# Altium schematic sheet Sch.SchDoc
size A3; SheetNumber: 1; SheetTotal: 1
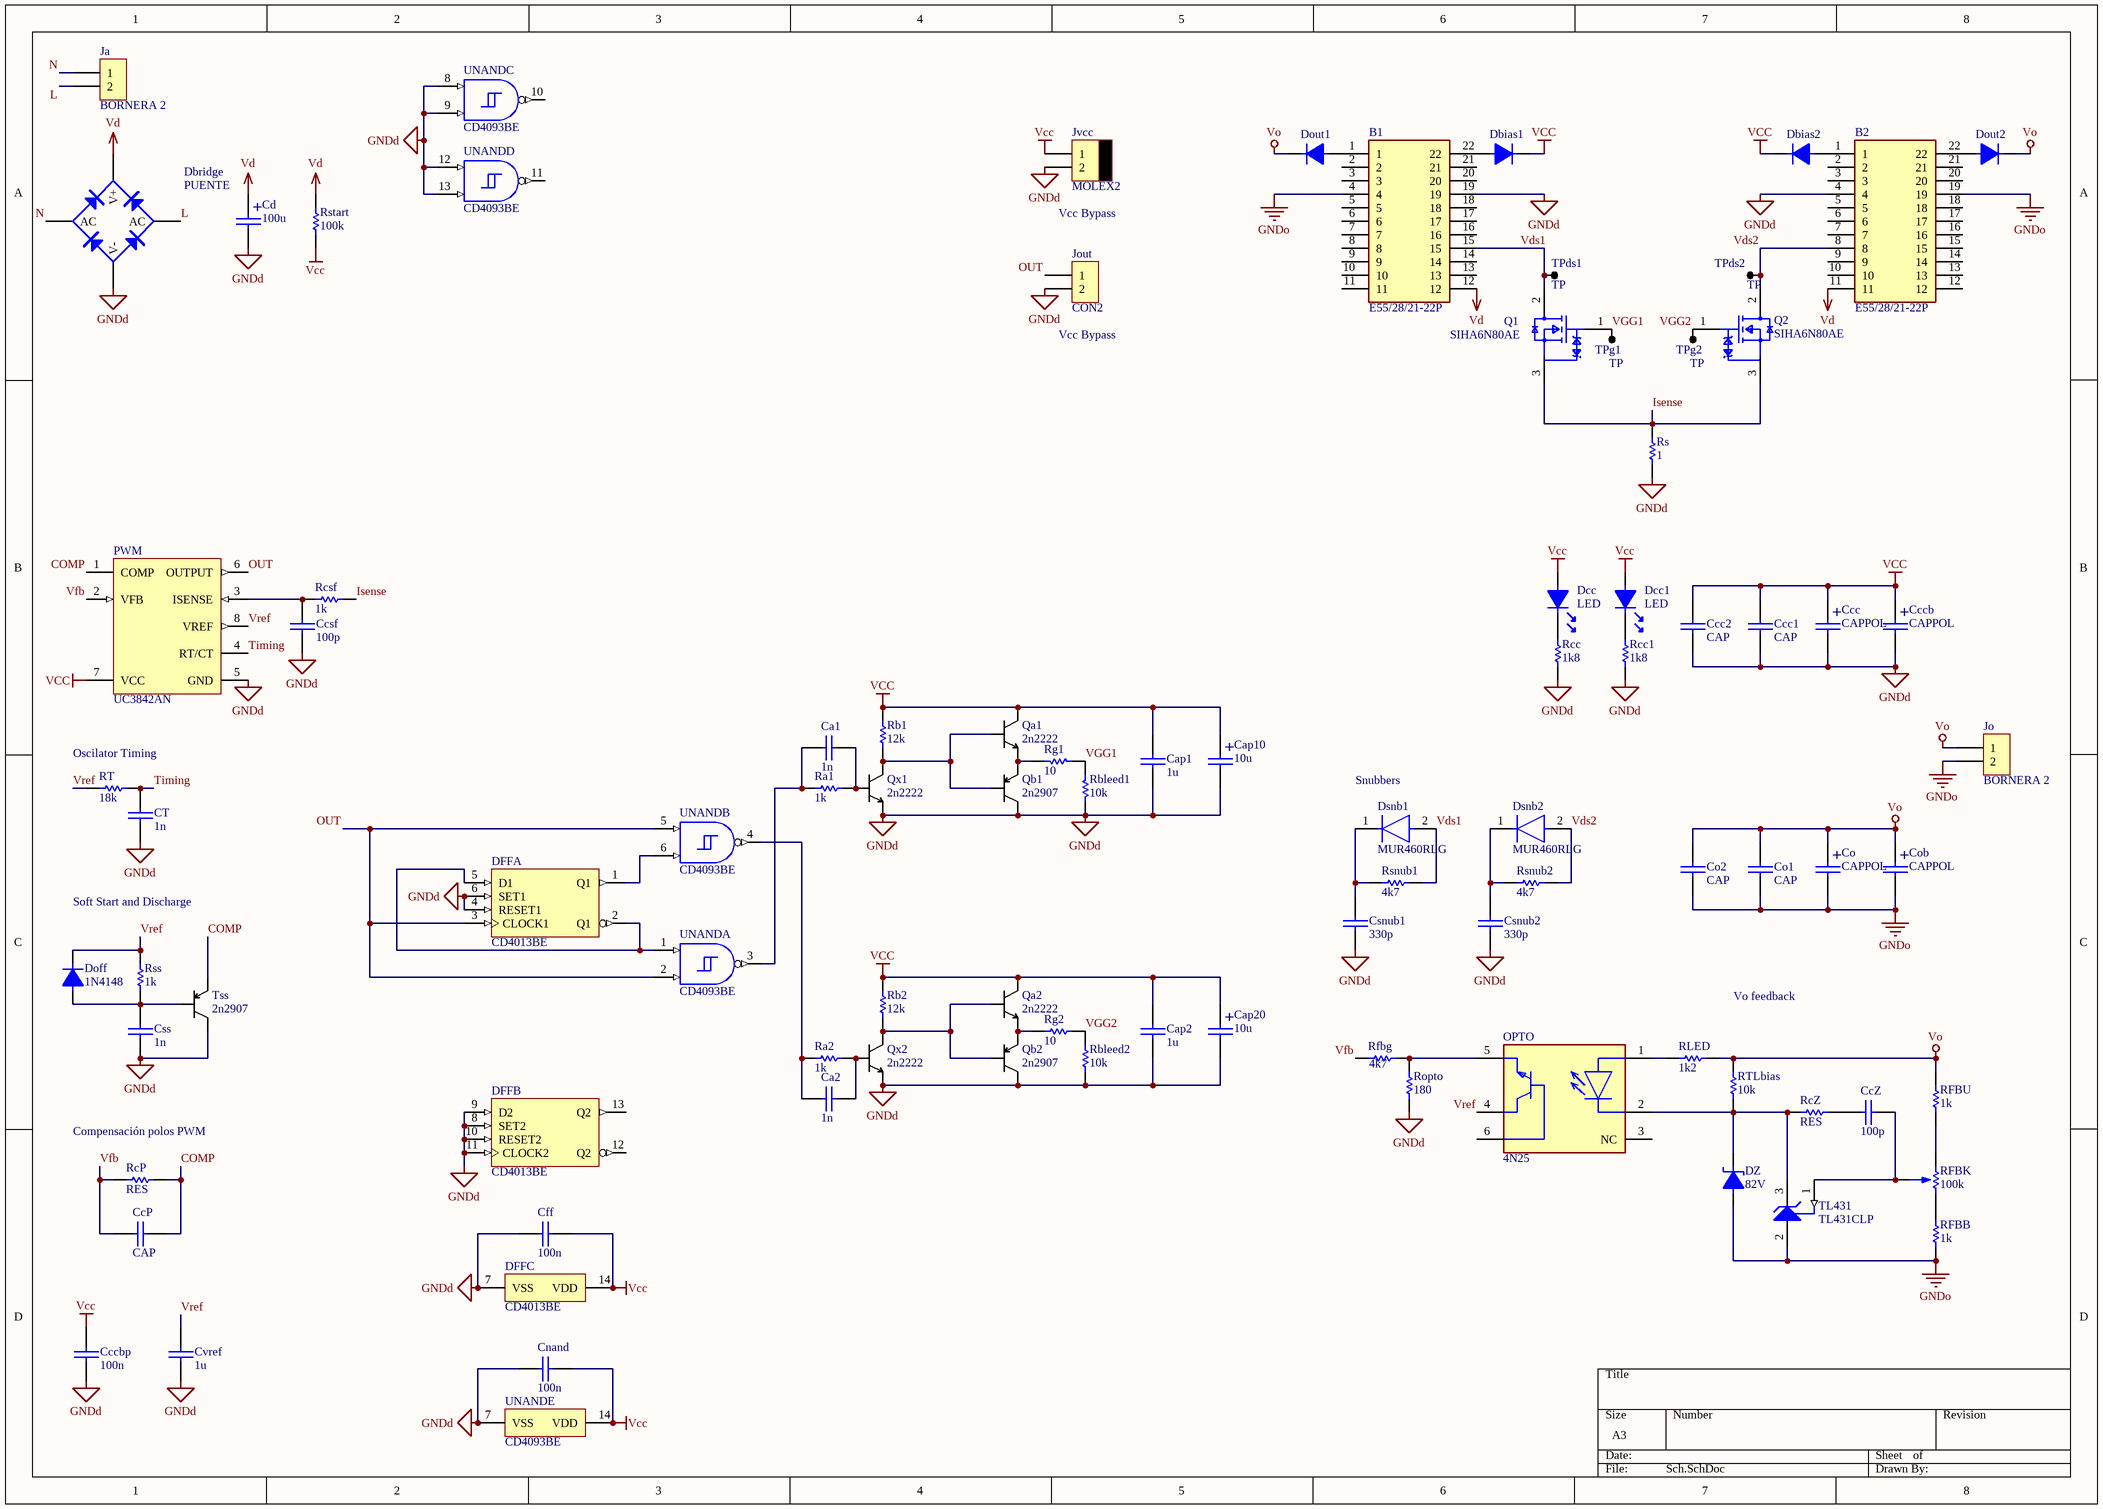
[diagram p0: Sch.SchDoc]

## Parts
B1  E55/28/21-22P  [DIPS4000W100P500L5500H4050Q22N]
B2  E55/28/21-22P  [DIPS4000W100P500L5500H4050Q22N]
Ca1  1n  [0805]
Ca2  1n  [0805]
Cap1  1u  [CAP100]
Cap2  1u  [CAP100]
Cap10  10u  [CAP100RP2]
Cap20  10u  [CAP100RP2]
Ccc  CAPPOL  [CAP200RP]
Ccc1  CAP  [CAP200]
Ccc2  CAP  [CAP200]
Cccb  CAPPOL  [CAP200RP]
Cccbp  100n  [CAP200]
CcP  CAP  [0805]
Ccsf  100p  [0805]
CcZ  100p  [CAP100]
Cd  100u  [CAP18P8]
Cff  100n  [0805]
Cnand  100n  [0805]
Co  CAPPOL  [CAP200RP]
Co1  CAP  [FILM]
Co2  CAP  [FILM]
Cob  CAPPOL  [CAP200RP]
Csnub1  330p  [CAP200]
Csnub2  330p  [CAP200]
Css  1n  [0805]
CT  1n  [0805]
Cvref  1u  [0805]
Dbias1  (no value)  [DO41]
Dbias2  (no value)  [DO41]
Dbridge  PUENTE  [PUENTE - W10M]
Dcc  LED  [LED3]
Dcc1  LED  [LED3]
DFF  CD4013BE  [N0014A]  (parts A,B,C of 3)
Doff  1N4148  [DO41]
Dout1  (no value)  [DO41]
Dout2  (no value)  [DO41]
Dsnb1  MUR460RLG  [FP-267-05-MFG]
Dsnb2  MUR460RLG  [FP-267-05-MFG]
DZ  82V  [DO41]
Ja  BORNERA 2  [BORNERA2]
Jo  BORNERA 2  [BORNERA2]
Jout  CON2  [SIP2]
Jvcc  MOLEX2  [MOLEX2]
OPTO  4N25  [FP-4N25-MFG]
PWM  UC3842AN  [P0008A]
Q1  SIHA6N80AE  [FP-TO-220FP-7012510-MFG]
Q2  SIHA6N80AE  [FP-TO-220FP-7012510-MFG]
Qa1  2n2222  [TO-18-W]
Qa2  2n2222  [TO-18-W]
Qb1  2n2907  [TO-18-W]
Qb2  2n2907  [TO-18-W]
Qx1  2n2222  [TO-18-W]
Qx2  2n2222  [TO-18-W]
Ra1  1k  [0805]
Ra2  1k  [0805]
Rb1  12k  [0805]
Rb2  12k  [0805]
Rbleed1  10k  [0805]
Rbleed2  10k  [0805]
Rcc  1k8  [RES300]
Rcc1  1k8  [RES300]
RcP  RES  [0805]
Rcsf  1k  [RES400]
RcZ  RES  [RES300]
RFBB  1k  [RES400]
Rfbg  4k7  [0805]
RFBK  100k  [PRESET V]
RFBU  1k  [RES400]
Rg1  10  [RES300]
Rg2  10  [RES300]
RLED  1k2  [RES300]
Ropto  180  [0805]
Rs  1  [RES600]
Rsnub1  4k7  [RES18]
Rsnub2  4k7  [RES18]
Rss  1k  [RES400]
Rstart  100k  [RES600]
RT  18k  [0805]
RTLbias  10k  [RES400]
TL431  TL431CLP  [LP0003A]
TPds1  TP  [TPTH]
TPds2  TP  [TPTH]
TPg1  TP  [TPTH]
TPg2  TP  [TPTH]
Tss  2n2907  [TO-18-W]
UNAND  CD4093BE  [N0014A]  (parts A,B,C,D,E of 5)

## Nets
GNDd: B1.19 B2.4 Cap1.2 Cap2.2 Cap10.2 Cap20.2 Ccc.2 Ccc1.2 Ccc2.2 Cccb.2 Cccbp.2 Ccsf.2 Cd.2 Cff.2 Cnand.2 Csnub1.2 Csnub2.2 Css.2 CT.2 Cvref.2 Dbridge.3(V-) DFF.4(RESET1) DFF.6(SET1) DFF.7(VSS) DFF.8(SET2) DFF.9(D2) DFF.10(RESET2) DFF.11(CLOCK2) Jout.2 Jvcc.2 PWM.5(GND) Qb1.3(C) Qb2.3(C) Qx1.1(E) Qx2.1(E) Rbleed1.2 Rbleed2.2 Rcc.1 Rcc1.1 Ropto.1 Rs.1 Tss.3(C) UNAND.7(VSS) UNAND.8(E) UNAND.9(F) UNAND.12(G) UNAND.13(H)
GNDo: B1.4 B2.19 Co.2 Co1.2 Co2.2 Cob.2 DZ.1 Jo.2 RFBB.2 TL431.2(ANODE)
Vcc: Cap1.1 Cap2.1 Cap10.1 Cap20.1 Ccc.1 Ccc1.1 Ccc2.1 Cccb.1 Cccbp.1 Cff.1 Cnand.1 Dbias1.2 Dbias2.2 Dcc.1 Dcc1.1 DFF.14(VDD) Jvcc.1 PWM.7(VCC) Qa1.3(C) Qa2.3(C) Rb1.2 Rb2.2 Rstart.1 UNAND.14(VDD)
Vd: B1.12 B2.11 Cd.1 Dbridge.1(V+) Rstart.2
Vo: Co.1 Co1.1 Co2.1 Cob.1 Dout1.2 Dout2.2 Jo.1 RFBU.1 RLED.2 RTLbias.2
COMP: CcP.2 PWM.1(COMP) RcP.2 Tss.1(E)
Isense: Q1.3(S) Q2.3(S) Rcsf.2 Rs.2
L: Dbridge.4(AC) Ja.2
N: Dbridge.2(AC) Ja.1
OUT: DFF.3(CLOCK1) Jout.1 PWM.6(OUTPUT) UNAND.2(B) UNAND.5(C)
Timing: CT.1 PWM.4(RT/CT) RT.1
Vds1: B1.15 Dsnb1.2(A) Q1.2(D) Rsnub1.1 TPds1.1
Vds2: B2.8 Dsnb2.2(A) Q2.2(D) Rsnub2.2 TPds2.1
Vfb: CcP.1 PWM.2(VFB) RcP.1 Rfbg.2
VGG1: Q1.1(G) Rbleed1.1 Rg1.1 TPg1.1
VGG2: Q2.1(G) Rbleed2.1 Rg2.2 TPg2.1
Vref: Cvref.1 Doff.2 OPTO.4(E) PWM.8(VREF) Rss.1 RT.2
NetB1_1: B1.1 Dout1.1
NetB1_22: B1.22 Dbias1.1
NetB2_1: B2.1 Dbias2.1
NetB2_22: B2.22 Dout2.1
NetCa1_1: Ca1.1 Ra1.2 UNAND.3(J)
NetCa1_2: Ca1.2 Qx1.2(B) Ra1.1
NetCa2_1: Ca2.1 Ra2.1 UNAND.4(K)
NetCa2_2: Ca2.2 Qx2.2(B) Ra2.2
NetCcsf_1: Ccsf.1 PWM.3(ISENSE) Rcsf.1
NetCcZ_1: CcZ.1 RcZ.2
NetCcZ_2: CcZ.2 RFBK.2 TL431.1(REF)
NetCsnub1_1: Csnub1.1 Dsnb1.1(C) Rsnub1.2
NetCsnub2_1: Csnub2.1 Dsnb2.1(C) Rsnub2.1
NetCss_1: Css.1 Doff.1 Rss.2 Tss.2(B)
NetDcc1_2: Dcc1.2 Rcc1.2
NetDcc_2: Dcc.2 Rcc.2
NetDFF_1: DFF.1(Q1) UNAND.6(D)
NetDFF_2: DFF.2(Q1) DFF.5(D1) UNAND.1(A)
NetDZ_2: DZ.2 OPTO.2(C) RcZ.1 RTLbias.1 TL431.3(CATHODE)
NetOPTO_1: OPTO.1(A) RLED.1
NetOPTO_5: OPTO.5(C) Rfbg.1 Ropto.2
NetQa1_1: Qa1.1(E) Qb1.1(E) Rg1.2
NetQa1_2: Qa1.2(B) Qb1.2(B) Qx1.3(C) Rb1.1
NetQa2_1: Qa2.1(E) Qb2.1(E) Rg2.1
NetQa2_2: Qa2.2(B) Qb2.2(B) Qx2.3(C) Rb2.1
NetRFBB_1: RFBB.1 RFBK.1
NetRFBK_3: RFBK.3 RFBU.2

Not connected (* = marked no-connect by the designer): B1 2 3 5 6 7 8 9 10 11 13 14 16 17 18 20 21; B2 2 3 5 6 7 9 10 12 13 14 15 16 17 18 20 21; DFF 12(Q2) 13(Q2); OPTO 3(NC) 6(B); UNAND 10(L) 11(M)

## Notes on the sheet
- Vcc Bypass
- (near Jout) Vcc Bypass
- (near RT) Oscilator Timing
- (near Dsnb1) Snubbers
- Soft Start and Discharge
- Vo feedback
- (near RcP) Compensación polos PWM
- (in symbol CAPPOL) +

## Library data of the parts
B1 B2 = CPH-E55_28_21-1S-22P-Z: COIL FORMER HORIZONTAL; Manufacturer_Name: FERROXCUBE; Manufacturer_Part_Number: CPH-E55/28/21-1S-22P-Z; Geometry.Height: 40.5mm; Mouser Part Number: *; Mouser Price/Stock: *; Arrow Part Number: *; Arrow Price/Stock: *; Datasheet Link: https://www.ferroxcube.com/upload/media/product/file/Pr_ds/E55_28_21.pdf
Ca1 Ca2 Cap1 Cap2 Cccbp Ccsf CcZ Cff Cnand Csnub1 Csnub2 Css CT Cvref = CAP
Cap10 Cap20 Cd = CAPPOL
Dbias1 Dbias2 Doff Dout1 Dout2 = DIODO
DFF = CMP-1619-00744-2: CMOS Dual D-Type Flip Flop, N0014A, TUBE; Manufacturer: Texas Instruments; Schmitt Trigger: No; F @ Nom Voltage(Max)(Mhz): 8; tpd @ Nom Voltage(Max)(ns): 130; Output Logic: Inverted,Non-inverted; Rating: Military; Technology Family: CD4000; Voltage(Nom)(V): 10; Bits(#): 2; Output Drive (IOL/IOH)(Max)(mA): 1.5/-1.5; VCC(Min)(V): 3; VCC(Max)(V): 18; ICC @ Nom Voltage(Max)(mA): 0.06; Generic Part Number: CD4013B; 3-State Output: No; DatasheetVersion: SCHS023D; Input Type: CMOS; Code_JEDEC: MS-001; Operating Temperature Range(C): -55 to 125; PackageReference: N0014A; Output Type: CMOS
Dsnb1 Dsnb2 = CMP-0902-00064-2: DIODE GEN PURP 600V 4A DO201AD; Manufacturer: On Semiconductor; Import Ts: 1521846900; Ciiva Ids: 19348431; Max Surge Forward Current: 110A; Peak Reverse Current: 10uA; Max Junction Temp: +175°C; Temperature Range High: +175°C; Device Class L3: Rectifier Diodes; RoHS: TRUE; Octopart: https://octopart.com/mur460rlg-on+semiconductor-332327; ComponentLink2URL: https://www.onsemi.com/pub/Collateral/MUR420-D.PDF; Reverse Voltage: 600V; Lead Free: Yes; Temperature: -65°C to +175°C; ComponentLink2Description: Datasheet; Manufacturer Part Number: MUR460RLG; Package: 267-05; Release Date: 1407122606; Height: 5.3mm; Automotive: No; Temperature Range Low: -65°C; Footprint Url: https://www.onsemi.com/pub/Collateral/267-05.PDF; Device Class L2: Diodes; Digikey Description: DIODE GEN PURP 600V 4A DO201AD; Device Class L1: Discrete Semiconductors; Forward Current: 4A; Max Repetitive Reverse Voltage: 600V; Ipc Land Pattern Name: DIOPA2094W145L950D530; Mouser Description: Diode Ultra Fast Recovery Rectifier 600V 4A 2-Pin Case 267-05 T/R; Category: Diode
DZ = DIODO ZENER
OPTO = CMP-22018-000009-1: OPTOISO 2.5KV TRANS W/BASE 6DIP; Isolation Voltage: 5kV; Reverse Breakdown Voltage: 5V; Forward Voltage: 1.5V; Rise Time: 2us; Max Power Dissipation: 250mW; Collector Emitter Breakdown Voltage: 30V; Max Collector Current: 100mA; Collector Emitter Saturation Voltage: 500mV; Power Dissipation: 150mW; Number of Elements: 1; Forward Current: 60mA; Output Voltage: 70V; Input Type: DC; Max Input Current: 80mA; Input Current: 50mA; Current Transfer Ratio: 50%; Number of Pins: 6; Min Operating Temperature: -55°C; Radiation Hardening: No; Case/Package: PDIP; Fall Time: 2us; Lead Free: Lead Free; Series: -; Max Operating Temperature: 100°C; Output Current per Channel: 100mA; Number of Circuits: 1; Collector Emitter Voltage (VCEO): 30V; Isolation Voltage-Max: 5kV; Collector-emitter Voltage-Max: 500mV; Packaging: Rail/Tube; Mount: Through Hole; Package Quantity: 2000; Max Output Voltage: 30V; Number of Channels: 1
PWM = CMP-0319-00071-2: PWM Controller with Current Control, 100 % Duty Cycle, 0 to +70 degC, 8-pin PDIP (P), Green (RoHS & no Sb/Br); Manufacturer: Texas Instruments; Duty Cycle(Max)(%): 100; Frequency(Max)(kHz): 450; Regulated Outputs(#): 1; Topology: Boost, Buck, Flyback, Forward; Rating: Catalog; UVLO Thresholds On/Off(V): 16/10; PartNumber: UC3842AN; DatasheetVersion: SLUS224C; Mounting Technology: Through Hole; ComponentLink1URL: http://www.ti.com/general/docs/lit/getliterature.tsp?genericPartNumber=UC3842A&fileType=pdf; Control Method: Current; SubFamily: PWM Controller; Code_JEDEC: MS-001-BA; PackageDescription: 8-Pin Plastic Dual-In-Line Package, Row Spacing 7.62 mm, Pitch 2.54 mm; Eco-Plan: Green (RoHS & no Sb/Br); PackageVersion: revE, Apr-2010; PackageReference: P0008A; ComponentLink1Description: Datasheet
Q1 Q2 = CMP-12198-000018-1: MOSFET N-CH 800V 12A TO-220FP; Manufacturer: STMicroelectronics; Manufacturer Part Number: STF13N80K5; Turn On Delay Time: 16ns; Input Capacitace At Vds: 870pF @ 100V; Drain To Source Resistance: 0.37Ω; Threshold Vgs Min: 3V; Standoff Height: 2.9mm; Max Forward Diode Voltage: 1.5V; Gate To Source Voltage: 30V; Power Dissipation: 35W; Rthja Max: 62.5°C/W; Max Junction Temp: +150°C; Gate Charge At Vgs: 29nC @ 10V; Reverse Recovery Time: 406ns; Threshold Vgs Max: 5V; Turn Off Delay Time: 42ns; Number Of N Channels: 1; Pulse Drain Current: 48A; Reverse Recovery Charge: 5700nC; Depletion Mode: False; ComponentLink2URL: https://www.st.com/resource/en/datasheet/stf13n80k5.pdf; Temperature Range Low: -55°C; Category: Trans; RoHS: TRUE; ComponentLink2Description: Datasheet; Device Class L2: Transistors; Package: TO-220FP-7012510; Temperature: -55°C to +150°C; Mouser Description: MOSFET N-Ch 800 V 0.37 Ohm 12 A Zener-protect; Drain To Source Breakdown Voltage: 800V; Automotive: No; Continuous Drain Current: 12A; Digikey Description: MOSFET N-CH 800V 12A TO-220FP; Height: 20mm; Temperature Range High: +150°C; Device Class L1: Discrete Semiconductors; Lead Free: Yes; Device Class L3: MOSFETs; Number Of Channels: 1; Octopart: https://octopart.com/stf13n80k5-stmicroelectronics-29487922; Drain To Source Voltage: 800V
Qa1 Qa2 Qx1 Qx2 = NPN
Qb1 Qb2 Tss = PNP
Ra1 Ra2 Rb1 Rb2 Rbleed1 Rbleed2 Rcc Rcc1 Rcsf RFBB Rfbg RFBU Rg1 Rg2 RLED Ropto Rs Rsnub1 Rsnub2 Rss Rstart RT RTLbias = RES
RFBK = PRESET
TL431 = CMP-0366-00032-2: Adjustable Precision Shunt Regulator, 34 ppm / degC, 100 mA, 0 to 70 degC, 3-pin TO-92 (LP), Pb-Free (RoHS); Manufacturer: Texas Instruments; Iout/Iz(Max)(mA): 100; SubFamily: Shunt Voltage Reference; Initial Accuracy @ 25/deg C(%): 2; VO Adj(Max)(V): 36; Temp Coeff(Max)(ppm/ degree C): 92; Temp Coeff(Typ)(ppm/ degree C): 34; Min Iz for Regulation(uA): 600; VO Adj(Min)(V): 2.495; Rating: Military; ComponentLink2Description: Datasheet; PackageReference: LP0003A; ComponentLink1URL: http://www.ti.com/; PackageDescription: Plastic Cylindrical Package, Formed Lead Option (TO-92); Code_JEDEC: TO-226; PartNumber: TL431CLP; ComponentLink2URL: http://www.ti.com/general/docs/lit/getliterature.tsp?genericPartNumber=TL431&fileType=pdf; Eco-Plan: Pb-Free (RoHS); DatasheetVersion: SLVS543M; Mounting Technology: Through Hole; ComponentLink3Description: Package Specification; ComponentLink1Description: Manufacturer URL; PackageVersion: 4040001-2/C; ComponentLink3URL: http://www.ti.com/litv/pdf/msot002a
UNAND = CMP-1627-00493-3: CMOS Quad 2-Input NAND Schmitt Triggers, N0014A, TUBE; Manufacturer: Texas Instruments; ICC @ Nom Voltage(Max)(mA): 0.06; VCC(Min)(V): 3; Rating: Catalog; Bits(#): 4; Technology Family: CD4000; Output Drive (IOL/IOH)(Max)(mA): 1.5/-1.5; VCC(Max)(V): 18; Voltage(Nom)(V): 10; Schmitt Trigger: Yes; F @ Nom Voltage(Max)(Mhz): 8; DatasheetVersion: SCHS115D; PackageReference: N0014A; Code_JEDEC: MS-001; Output Type: CMOS; Input Type: CMOS; Generic Part Number: CD4093B; Operating Temperature Range(C): -55 to 125